# EAGLE design Nokia-Breakout-v14 (EAGLE 6.1)
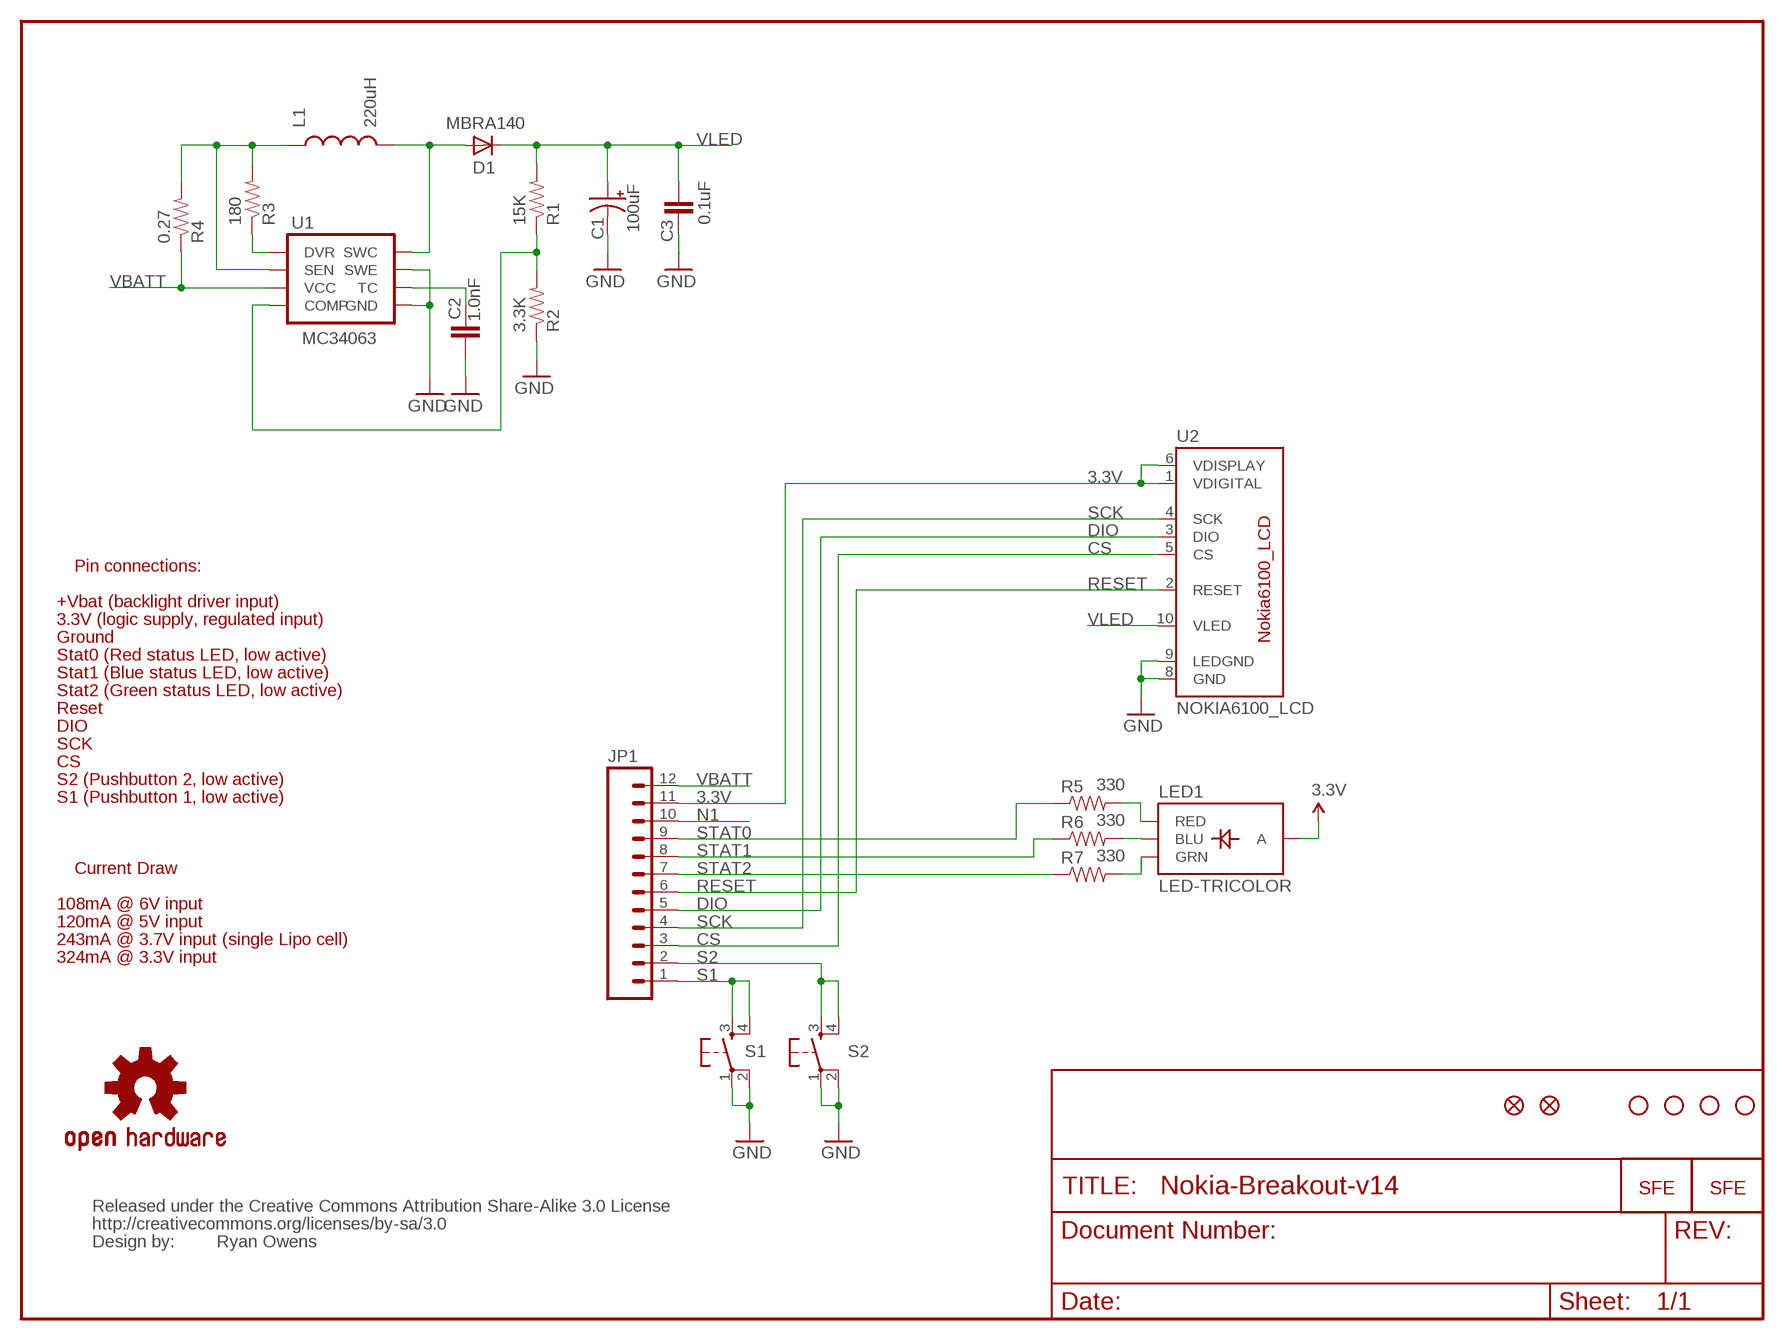
[diagram p0: schematic, sheet 1]

## Parts
C1  100uF  CAP_POL7343  [EIA7343]
C2  1.0nF  CAP0402-CAP  [0402-CAP]
C3  0.1uF  CAP0402-CAP  [0402-CAP]
D1  MBRA140  DIODESMA  [SMA-DIODE]
JP1  M12PTH  [1X12]
JP2  FIDUCIALUFIDUCIAL  [MICRO-FIDUCIAL]
JP3  FIDUCIALUFIDUCIAL  [MICRO-FIDUCIAL]
L1  220uH  INDUCTORNPI75  [NPI75C]
LED1  LED-TRICOLOR  [LED-TRICOLOR-SMD]
R1  15K  RESISTOR0402-RES  [0402-RES]
R2  3.3K  RESISTOR0402-RES  [0402-RES]
R3  180  RESISTOR0402-RES  [0402-RES]
R4  0.27  RESISTOR0402-RES  [0402-RES]
R5  330  RESISTOR0402-RES  [0402-RES]
R6  330  RESISTOR0402-RES  [0402-RES]
R7  330  RESISTOR0402-RES  [0402-RES]
S1  TAC_SWITCHSMD  [TACTILE_SWITCH_SMD]
S2  TAC_SWITCHSMD  [TACTILE_SWITCH_SMD]
U1  MC34063  MC34063SMD  [SO08]
U2  NOKIA6100_LCD  [NOKIA6100_LCD]
U$1  STAND-OFF  [STAND-OFF]
U$2  STAND-OFF  [STAND-OFF]
U$3  STAND-OFF  [STAND-OFF]
U$5  STAND-OFF  [STAND-OFF]
U$8  LOGO-SFENEW  [SFE-NEW-WEBLOGO]
U$9  OSHW-LOGOS  [OSHW-LOGO-S]
U$10  CREATIVE_COMMONS  [CREATIVE_COMMONS]
U$12  LOGO-SFESK  [SFE-LOGO-FLAME]

## Nets
3.3V: JP1.11 LED1.A U2.1(VDIGITAL) U2.6(VDISPLAY)
CS: JP1.3 U2.5(CS)
DIO: JP1.5 U2.3(DIO)
N1: C1.C(-) C2.2 C3.2 JP1.10 R2.1 S1.1 S1.2 S2.1 S2.2 U1.2(SWE) U1.4(GND) U2.8(GND) U2.9(LEDGND) ; supply symbol labelled GND
N$1: LED1.R(RED) R5.2
N$2: D1.A L1.2 U1.1(SWC)
N$3: L1.1 R3.2 R4.2 U1.7(SEN)
N$4: R3.1 U1.8(DVR)
N$8: R1.1 R2.2 U1.5(COMP)
N$9: C2.1 U1.3(TC)
N$10: LED1.G(GRN) R7.2
N$11: LED1.B(BLU) R6.2
RESET: JP1.6 U2.2(RESET)
S1: JP1.1 S1.3 S1.4
S2: JP1.2 S2.3 S2.4
SCK: JP1.4 U2.4(SCK)
STAT0: JP1.9 R5.1
STAT1: JP1.8 R6.1
STAT2: JP1.7 R7.1
VBATT: JP1.12 R4.1 U1.6(VCC)
VLED: C1.A(+) C3.1 D1.C R1.2 U2.10(VLED)

## Notes on the sheet
- Pin connections:
- +Vbat (backlight driver input)
- 3.3V (logic supply, regulated input)
- Ground
- Stat0 (Red status LED, low active)
- Stat1 (Blue status LED, low active)
- Stat2 (Green status LED, low active)
- Reset
- DIO
- SCK
- CS
- S2 (Pushbutton 2, low active)
- S1 (Pushbutton 1, low active)
- Current Draw
- 108mA @ 6V input
- 120mA @ 5V input
- 243mA @ 3.7V input (single Lipo cell)
- 324mA @ 3.3V input
- Ryan Owens

## Library data of the parts
C1 = SparkFun:CAP_POL: Capacitor Polarized These are standard SMD and PTH capacitors. Normally 10uF, 47uF, and 100uF in electrolytic and tantalum varieties. Always verify the external diameter of the through hole cap, it varies with capacity, voltage, and manufacturer. The EIA devices should be standard.
C2 C3 = SparkFun:CAP: Capacitor Standard 0603 ceramic capacitor, and 0.1" leaded capacitor.
D1 = SparkFun:DIODE: Diode These are standard reverse protection diodes and small signal diodes. SMA package can handle up to about 1A. SOD-323 can handle about 200mA. What the SOD-323 package when ordering, there are some mfgs out there that are 5-pin packages.
JP1 = SparkFun:M12: Header 12 Standard 12-pin 0.1" header. Use with straight break away headers (SKU : PRT-00116), right angle break away headers (PRT-00553), swiss pins (PRT-00743), machine pins (PRT-00117), and female headers (PRT-00115).
JP2 JP3 = SparkFun:FIDUCIAL: Fiducial Alignment Points Various fiducial points for machine vision alignment.
L1 = SparkFun:INDUCTOR: Inductors Basic Inductor/Choke - 0603 and 1206. Footprints are not proven and vary greatly between part numbers.
LED1 = SparkFun:LED-TRICOLOR: Tri-Color LED SMD Proven layout and schematic for triple color LED in SMD package - common anode. Spark Fun Electronics SKU : COM-07844
R1-R7 = SparkFun:RESISTOR: Resistor Basic schematic elements and footprints for 0603, 1206, and PTH resistors.
S1 S2 = SparkFun:TAC_SWITCH: Momentary Switch Button commonly used for reset or general input. Spark Fun Electronics SKU : COM-00097
U1 = SparkFun:MC34063
U2 = SparkFun:NOKIA6100_LCD: Nokia 6100 Color LCD Schematic element and footprint production proven but could use some touching up. Spark Fun Electronics SKU : LCD-00569. Mating SMD connector : LCD-00570
U$1-U$3 U$5 = SparkFun:STAND-OFF: Stand Off This is the mechanical footprint for a #4 phillips button head screw. Use the keepout ring to avoid running the screw head into surrounding components. SKU : PRT-00447
U$8 U$12 = SparkFun:LOGO-SFE: Spark Fun Electronics PCB Logo This is the standard Spark Fun Electronics PCB logo.
U$9 = SparkFun:OSHW-LOGO: Open Source Hardware Logo This logo indicates the piece of hardware it is found on incorporates a OSHW license and/or adheres to the definition of open source hardware found here: http://freedomdefined.org/OSHW
U$10 = SparkFun:CREATIVE_COMMONS

## Board
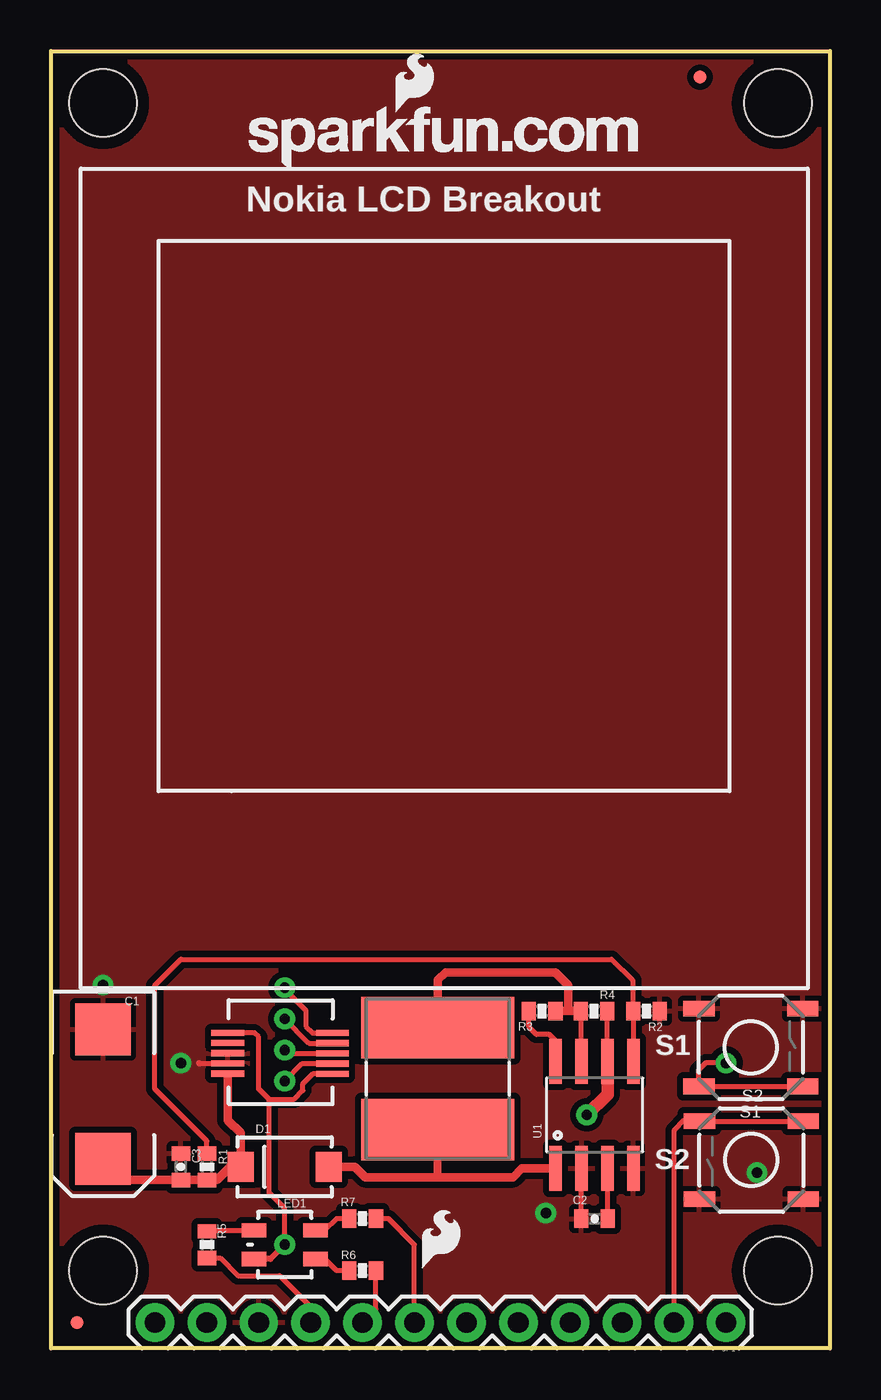
[diagram p1: board, top side]
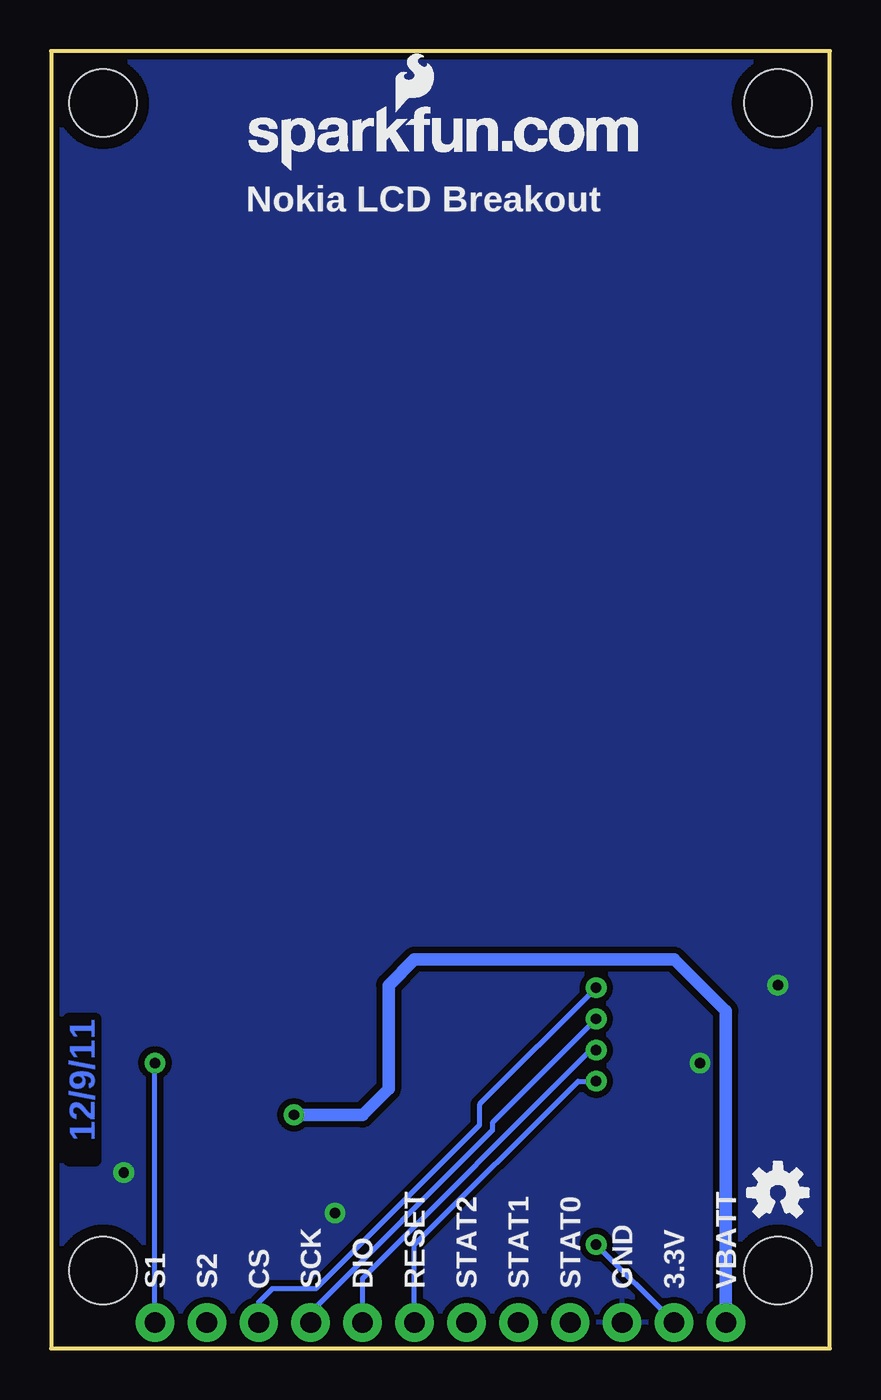
[diagram p2: board, bottom side, seen from below]

Size 38.1 x 63.5 mm. Coordinates in mm from the lower left corner, seen from the top.
Outline: 38.1,63.5 38.1,0 0,0 0,63.5 38.1,63.5
Copper layers (1*16): Top 0.035mm / dielectric 1.5mm / Bottom 0.035mm
Design rules: minimum track width 8mil, minimum drill 20mil, track to track 8mil, track to pad 8mil, pad to pad 8mil, via to via 8mil, smd to smd 8mil, copper to edge 8mil, drill to drill 8mil, minimum pad ring 12mil, minimum via ring 10mil, stop-mask expansion 4mil, vias tented up to drill 20mil, thermal gap 10mil

### Footprints (pad centres in the part's own frame; a part is rotated, then mirrored left to right if it is on the bottom)
EIA7343 = smd 2.55 x 2.7: A 3.17,0; C -3.17,0
0402-CAP = smd 0.7 x 0.9: 1 -0.65,0; 2 0.65,0
SMA-DIODE = smd 1.27 x 1.47: A -2.15,0; C 2.15,0
1X12 = drill 1.016 pad 1.88: 1 0,0; 2 2.54,0; 3 5.08,0; 4 7.62,0; 5 10.16,0; 6 12.7,0; 7 15.24,0; 8 17.78,0; 9 20.32,0; 10 22.86,0; 11 25.4,0; 12 27.94,0
MICRO-FIDUCIAL = smd 0.635 x 0.635: 1 0,0
NPI75C = smd 3 x 7.5: 1 -2.5,0; 2 2.5,0
LED-TRICOLOR-SMD = smd 0.7 x 1.2: A 0.7,-1.5; B 0.7,1.5; G -0.7,1.5; R -0.7,-1.5
0402-RES = smd 0.7 x 0.9: 1 -0.65,0; 2 0.65,0
TACTILE_SWITCH_SMD = smd 1.524 x 0.762: 1 -2.54,1.905; 2 2.54,1.905; 3 -2.54,-1.905; 4 2.54,-1.905
SO08 = smd 0.61 x 2.21: 1 -1.905,-2.616; 2 -0.635,-2.616; 3 0.635,-2.616; 4 1.905,-2.616; 5 1.905,2.616; 6 0.635,2.616; 7 -0.635,2.616; 8 -1.905,2.616
NOKIA6100_LCD = smd 1.6 x 0.3: 1 24.255,44.311; 2 24.255,43.811; 3 24.255,43.311; 4 24.255,42.811; 5 24.255,42.311; 6 29.389,42.303; 7 29.389,42.803; 8 29.389,43.303; 9 29.389,43.803; 10 29.389,44.303
STAND-OFF = hole 3.302: 0,0

### Placement (x,y rotation side)
C1  2.54,12.45 270 top
C2  26.59,6.35 180 top
C3  6.35,8.89 90 top
D1  11.43,8.89 180 top
JP1  33.02,1.27 180 top
JP2  1.27,1.27 0 top
JP3  31.75,62.23 0 top
L1  18.92,13.21 270 top
LED1  11.43,5.08 270 top
R1  7.62,8.89 270 top
R2  29.13,16.51 180 top
R3  24.03,16.51 0 top
R4  26.57,16.51 180 top
R5  7.62,5.08 90 top
R6  15.24,3.81 180 top
R7  15.24,6.35 180 top
S1  34.24,14.73 0 top
S2  34.26,9.22 180 top
U1  26.59,11.43 0 top
U2  38.03,57.75 180 top
U$1  2.54,3.81 0 top
U$2  35.56,3.81 0 top
U$3  2.54,60.96 0 top
U$4  LOGO-SFENEW  [SFE-NEW-WEBLOGO]  9.65,57.66 0 top
U$5  35.56,60.96 0 top
U$8  28.45,57.66 0 bottom
U$9  2.54,7.62 0 bottom
U$10  20.32,-8.89 0 top  (outside the outline)
U$12  18.16,3.94 0 top

### Tracks (layer width: path | path; a pad name or v marks a point on that pad's centre or on a via)
3.3V  (via drill 0.51)
  Top 0.254: v11.43,5.08 11.43,6.86 10.67,7.62 10.67,12.19 | 10.67,12.19 10.16,12.7 10.16,15.24 9.95,15.45 U2.6 | 10.67,12.19 11.89,12.19 12.32,12.62 12.32,12.95 12.83,13.46 13.76,13.46 U2.1
  Top 0.305: LED1.A 10.73,4.38 v11.43,5.08
  Bottom 0.254: JP1.11 v11.43,5.08
CS  (via drill 0.51)
  Top 0.254: U2.5 12.8,15.44 12.47,15.77 12.47,16.54 11.43,17.58 v11.43,17.65
  Bottom 0.254: JP1.3 27.94,2.26 27.28,2.92 25.15,2.92 17.14,10.92 17.14,11.94 v11.43,17.65
DIO  (via drill 0.51)
  Top 0.254: U2.3 11.59,14.44 v11.43,14.61
  Bottom 0.254: JP1.5 22.86,3.43 11.68,14.61 v11.43,14.61
N1  (via drill 0.51)
  Top 0.254: 7.26,13.95 U2.9 | C2.2 25.94,8.8 U1.2
  Top 0.305: 7.26,13.95 7.24,13.97
  other vias: 6.35,13.97 24.21,6.63 2.54,17.78 34.54,8.61
  pour Bottom (isolate 0.305): 38.1,0 38.1,63.5 0,63.5 0,0
  pour Top (isolate 0.305): 38.1,0 38.1,63.5 0,63.5 0,0
N$1
  Top 0.254: LED1.R 7.67,5.78 R5.2
N$2
  Top 0.254: 19.05,8.38 18.92,8.51
  Top 0.381: 18.92,8.51 L1.2
  Top 0.406: D1.A 14.86,8.89 15.37,8.38 19.05,8.38 22.61,8.38 23.04,8.81 U1.1
N$3
  Top 0.254: R4.2 25.92,14.09 U1.7
  Top 0.406: 25.3,16.51 R4.2 | 25.3,16.51 R3.2 | L1.1 18.92,18.03 19.3,18.41 24.66,18.41 25.3,17.78 25.3,16.51
N$4
  Top 0.254: R3.1 23.38,15.74 23.75,15.37 24.38,15.37 24.77,14.99 24.77,14.12 U1.8
N$8
  Top 0.254: R1.1 7.62,10.16 5.08,12.7 5.08,17.78 6.35,19.05 27.43,19.05 28.45,18.03 28.45,16.54 R2.2 28.48,14.06 U1.5
N$9
  Top 0.254: C2.1 27.24,8.8 U1.3
N$10
  Top 0.254: LED1.G 13.4,5.78 13.97,6.35 R7.2 14.61,6.35
N$11
  Top 0.254: LED1.B 13.4,4.38 13.97,3.81 R6.2
RESET  (via drill 0.51)
  Top 0.254: v11.43,13.08 12.29,13.95 12.29,13.94 U2.2
  Bottom 0.254: JP1.6 20.32,5.08 12.32,13.08 v11.43,13.08
S1  (via drill 0.51)
  Top 0.254: S1.3 S1.4 | S1.3 31.67,12.8 | v33.02,13.97 32.03,13.97 31.67,13.61 31.67,12.85 S1.3
  Bottom 0.254: JP1.1 v33.02,13.97
S2
  Top 0.254: JP1.2 30.48,10.67 30.99,11.18 31.67,11.18 S2.4 S2.3
SCK  (via drill 0.51)
  Top 0.254: U2.4 12.62,14.94 v11.43,16.13
  Bottom 0.254: JP1.4 25.4,1.78 16.51,10.67 16.51,11.05 v11.43,16.13
STAT0
  Top 0.254: R5.1 8.27,4.43 9.14,3.56 11.18,3.56 12.7,2.03 JP1.9
STAT1
  Top 0.254: R6.1 15.89,1.92 JP1.8
STAT2
  Top 0.254: R7.1 16.51,6.35 17.78,5.08 JP1.7
VBATT  (via drill 0.51)
  Top 0.254: 27.22,14.06 R4.1 | 27.22,14.06 U1.6 | 27.22,14.06 27.22,14 27.23,13.99
  Top 0.61: 27.23,13.99 27.23,12.45 v26.21,11.43
  Bottom 0.61: JP1.12 5.08,16.51 7.62,19.05 20.32,19.05 21.59,17.78 21.59,12.7 22.86,11.43 v26.21,11.43
VLED
  Top 0.254: C1.A 2.54,8.38 2.66,8.26 | U2.10 8.64,13.34 | 8.64,11.17 8.64,11.18
  Top 0.406: D1.C 8.76,8.89 8.13,8.26 7.62,8.26 R1.2 6.37,8.24 6.35,8.26 C3.1 2.68,8.24 2.66,8.26 | 8.64,11.17 9.27,10.54 D1.C | D1.C | 8.64,11.18 8.64,13.34

### Text on the board
Bottom: 12/9/11
tPlace: Nokia LCD Breakout | S1 | S2
bPlace: Nokia LCD Breakout | VBATT | 3.3V | GND | STAT0 | STAT1 | STAT2 | RESET | DIO | SCK | CS | S2 | S1
tValues: Pushbutton | Nokia Display | Tricolor LED